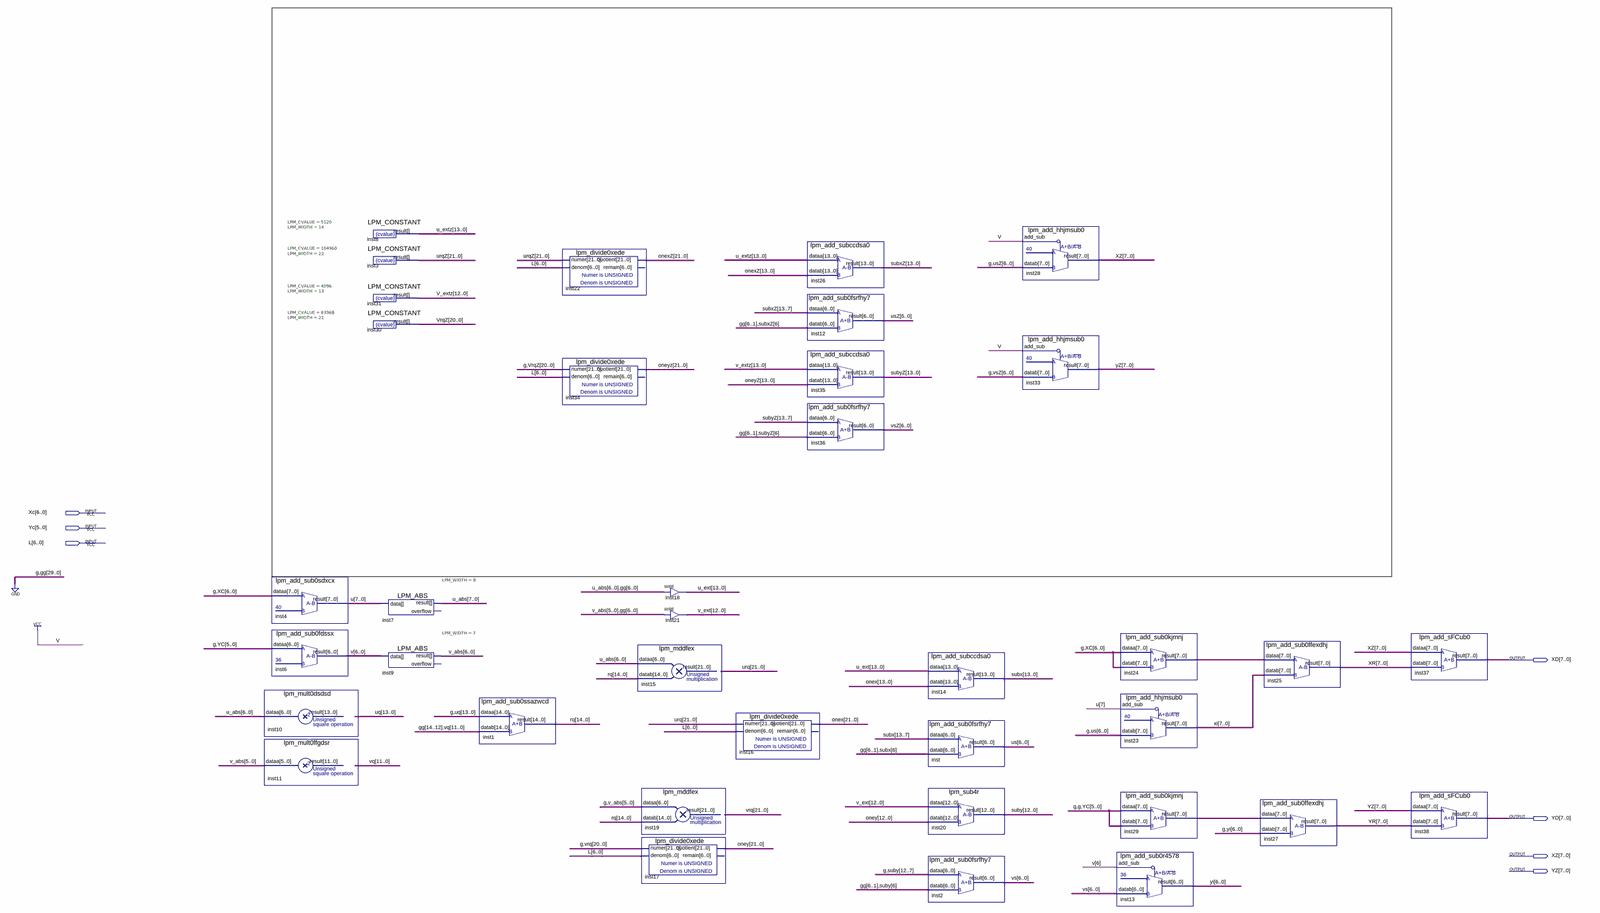
[diagram p0: schematic sheet, whole]
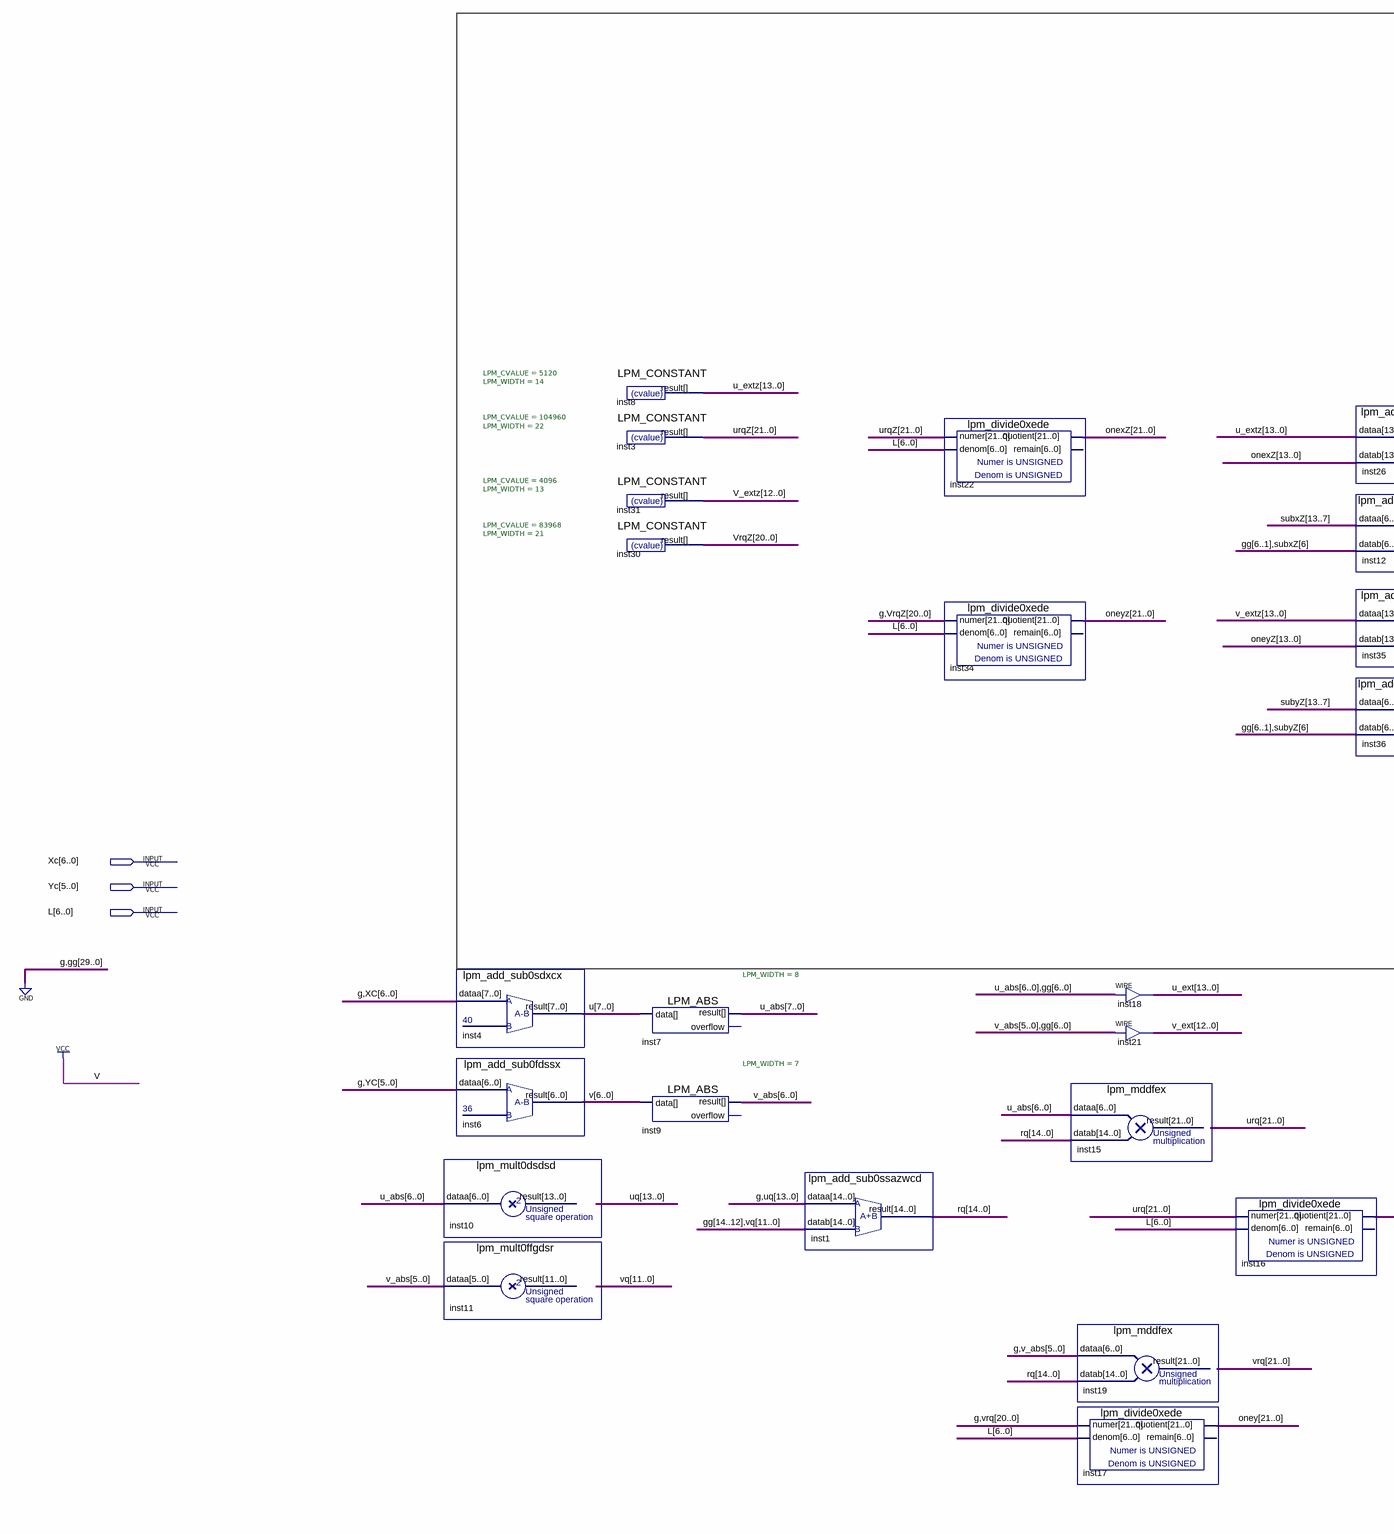
[diagram p1: schematic sheet, left part]
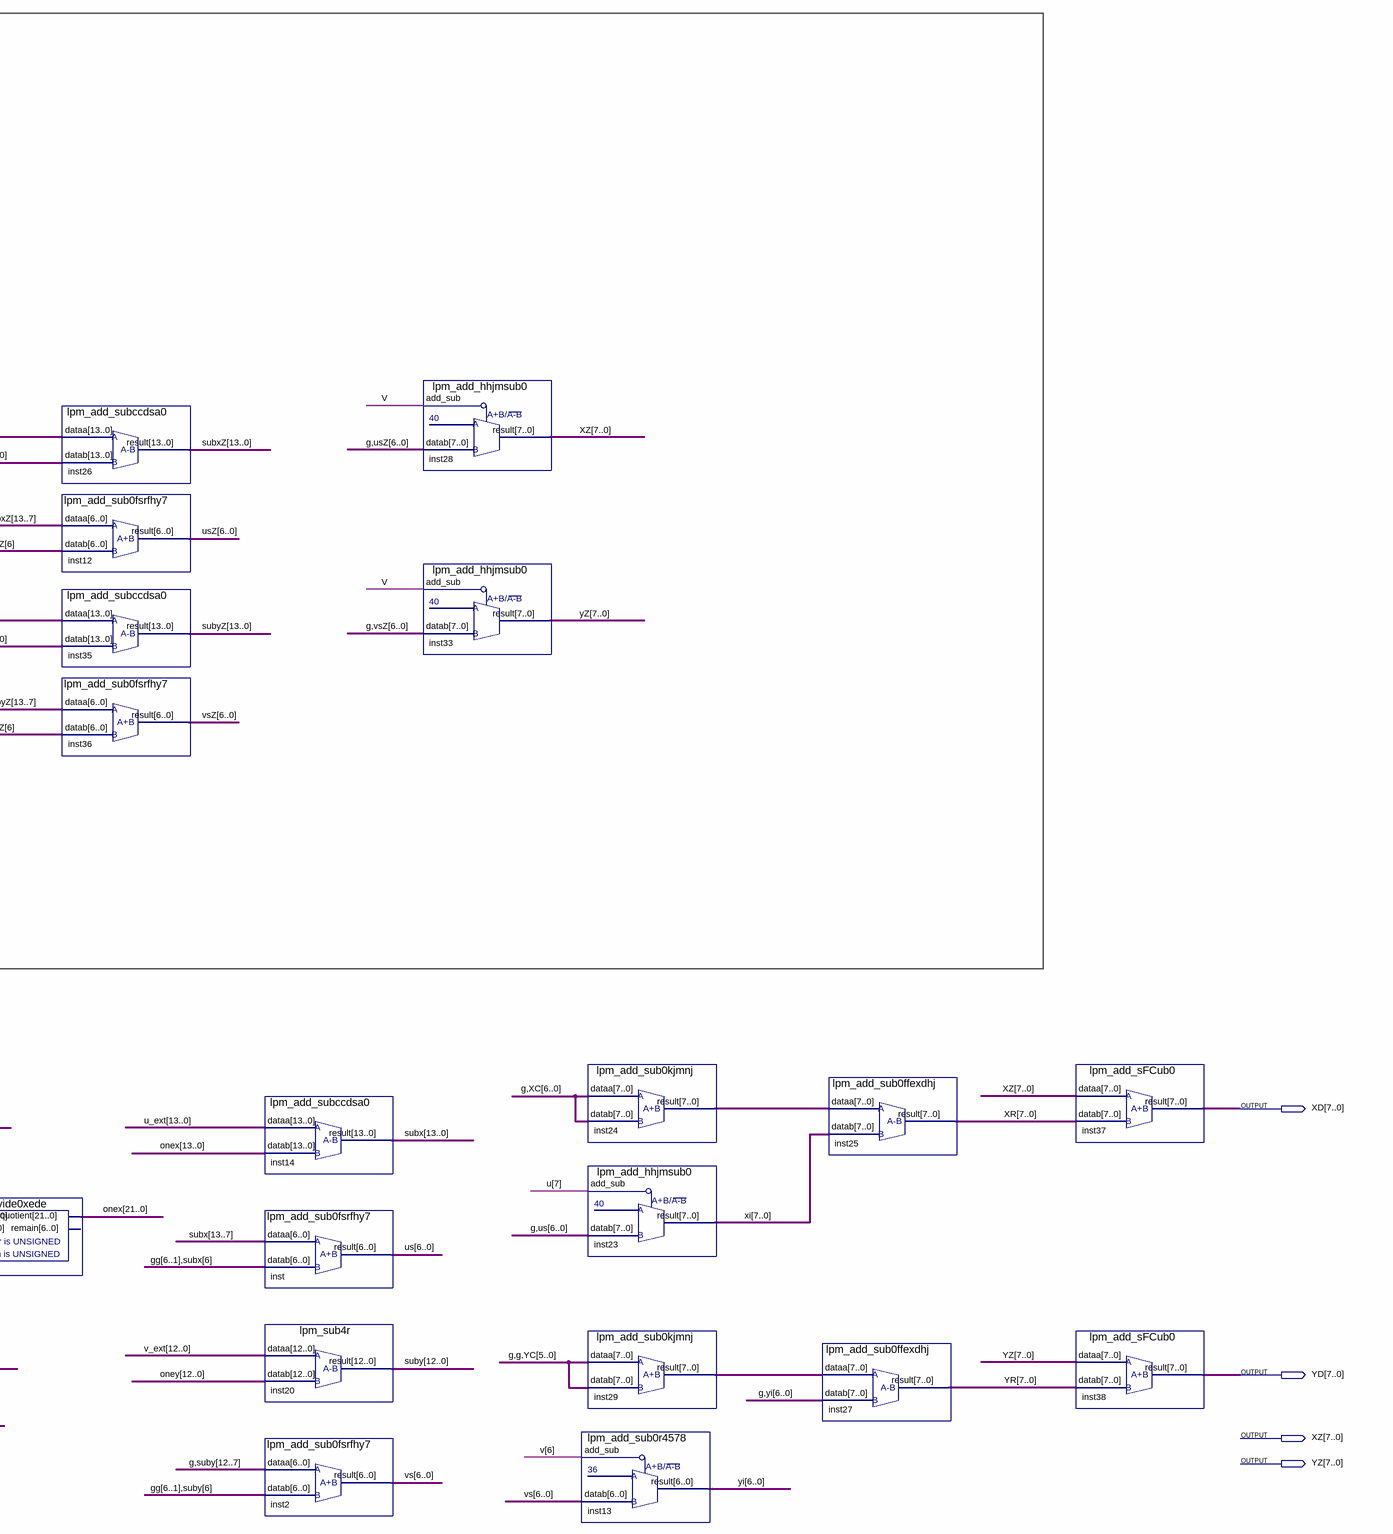
[diagram p2: schematic sheet, right part]
// Quartus schematic Distortion.bdf as structural Verilog: 37 symbols, 7 pins
module Distortion (
  input  [6:0] Xc,
  input  [5:0] Yc,
  input  [6:0] L,
  output [7:0] XD,
  output [7:0] YD,
  output [7:0] XZ,
  output [7:0] YZ
);

  wire [6:0] us, usZ, V, v_abs, vs, vsZ, yi;
  wire [7:0] inst24_result, inst29_result, u, u_abs, xi, XR, YR;
  wire [11:0] vq;
  wire [12:0] suby, v_ext;
  wire [13:0] subx, subxZ, subyZ, u_ext, u_extz, uq, V_extz;
  wire [14:0] rq;
  wire [20:0] VrqZ;
  wire [21:0] onex, onexZ, oney, oneyZ, urq, urqZ, vrq;

  lpm_mult0dsdsd inst10 (.dataa(u_abs[6:0]), .result(uq));
  lpm_mult0ffgdsr inst11 (.dataa(v_abs[5:0]), .result(vq));
  lpm_add_sub0sdxcx inst4 (.dataa({1'b0, Xc}), .result(u));
  lpm_add_sub0fdssx inst6 (.dataa({1'b0, Yc}), .result(V));
  LPM_CONSTANT #(.LPM_CVALUE(5120), .LPM_WIDTH(14)) inst8 (.result(u_extz));
  LPM_CONSTANT #(.LPM_CVALUE(104960), .LPM_WIDTH(22)) inst3 (.result(urqZ));
  LPM_CONSTANT #(.LPM_CVALUE(4096), .LPM_WIDTH(13)) inst31 (.result(V_extz[12:0]));
  LPM_CONSTANT #(.LPM_CVALUE(83968), .LPM_WIDTH(21)) inst30 (.result(VrqZ));
  LPM_ABS #(.LPM_WIDTH(8)) inst7 (.data(u), .result(u_abs));  // open: overflow
  LPM_ABS #(.LPM_WIDTH(7)) inst9 (.data(V), .result(v_abs));  // open: overflow
  lpm_add_sub0ssazwcd inst1 (.dataa({1'b0, uq}), .datab({3'b000, vq}), .result(rq));
  lpm_divide0xede inst22 (.numer(urqZ), .denom(L), .quotient(onexZ));  // open: remain
  lpm_divide0xede inst34 (.numer({1'b0, VrqZ}), .denom(L), .quotient(oneyZ));  // open: remain
  lpm_mddfex inst15 (.dataa(u_abs[6:0]), .datab(rq), .result(urq));
  lpm_mddfex inst19 (.dataa({1'b0, v_abs[5:0]}), .datab(rq), .result(vrq));
  lpm_divide0xede inst17 (.numer({1'b0, vrq[20:0]}), .denom(L), .quotient(oney));  // open: remain
  assign u_ext = {u_abs[6:0], {7{1'b0}}};  // WIRE inst18
  assign v_ext = {v_abs[5:0], {7{1'b0}}};  // WIRE inst21
  lpm_divide0xede inst16 (.numer(urq), .denom(L), .quotient(onex));  // open: remain
  lpm_add_subccdsa0 inst26 (.dataa(u_extz), .datab(onexZ[13:0]), .result(subxZ));
  lpm_add_sub0fsrfhy7 inst12 (.dataa(subxZ[13:7]), .datab({{6{1'b0}}, subxZ[6]}), .result(usZ));
  lpm_add_subccdsa0 inst35 (.dataa(V_extz), .datab(oneyZ[13:0]), .result(subyZ));
  lpm_add_sub0fsrfhy7 inst36 (.dataa(subyZ[13:7]), .datab({{6{1'b0}}, subyZ[6]}), .result(vsZ));
  lpm_add_subccdsa0 inst14 (.dataa(u_ext), .datab(onex[13:0]), .result(subx));
  lpm_add_sub0fsrfhy7 inst (.dataa(subx[13:7]), .datab({{6{1'b0}}, subx[6]}), .result(us));
  lpm_sub4r inst20 (.dataa(v_ext), .datab(oney[12:0]), .result(suby));
  lpm_add_sub0fsrfhy7 inst2 (.dataa({1'b0, suby[12:7]}), .datab({{6{1'b0}}, suby[6]}), .result(vs));
  lpm_add_hhjmsub0 inst28 (.add_sub(~1'b1), .datab({1'b0, usZ}), .result(XZ));
  lpm_add_hhjmsub0 inst33 (.add_sub(~1'b1), .datab({1'b0, vsZ}), .result(YZ));
  lpm_add_sub0kjmnj inst24 (.dataa({1'b0, Xc}), .datab({1'b0, Xc}), .result(inst24_result));
  lpm_add_hhjmsub0 inst23 (.add_sub(~u[7]), .datab({1'b0, us}), .result(xi));
  lpm_add_sub0kjmnj inst29 (.dataa({2'b00, Yc}), .datab({2'b00, Yc}), .result(inst29_result));
  lpm_add_sub0r4578 inst13 (.add_sub(~V[6]), .datab(vs), .result(yi));
  lpm_add_sub0ffexdhj inst25 (.dataa(inst24_result), .datab(xi), .result(XR));
  lpm_add_sub0ffexdhj inst27 (.dataa(inst29_result), .datab({1'b0, yi}), .result(YR));
  lpm_add_sFCub0 inst37 (.dataa(XZ), .datab(XR), .result(XD));
  lpm_add_sFCub0 inst38 (.dataa(YZ), .datab(YR), .result(YD));
endmodule
